# EAGLE design usb-ri (EAGLE 7.7.0)
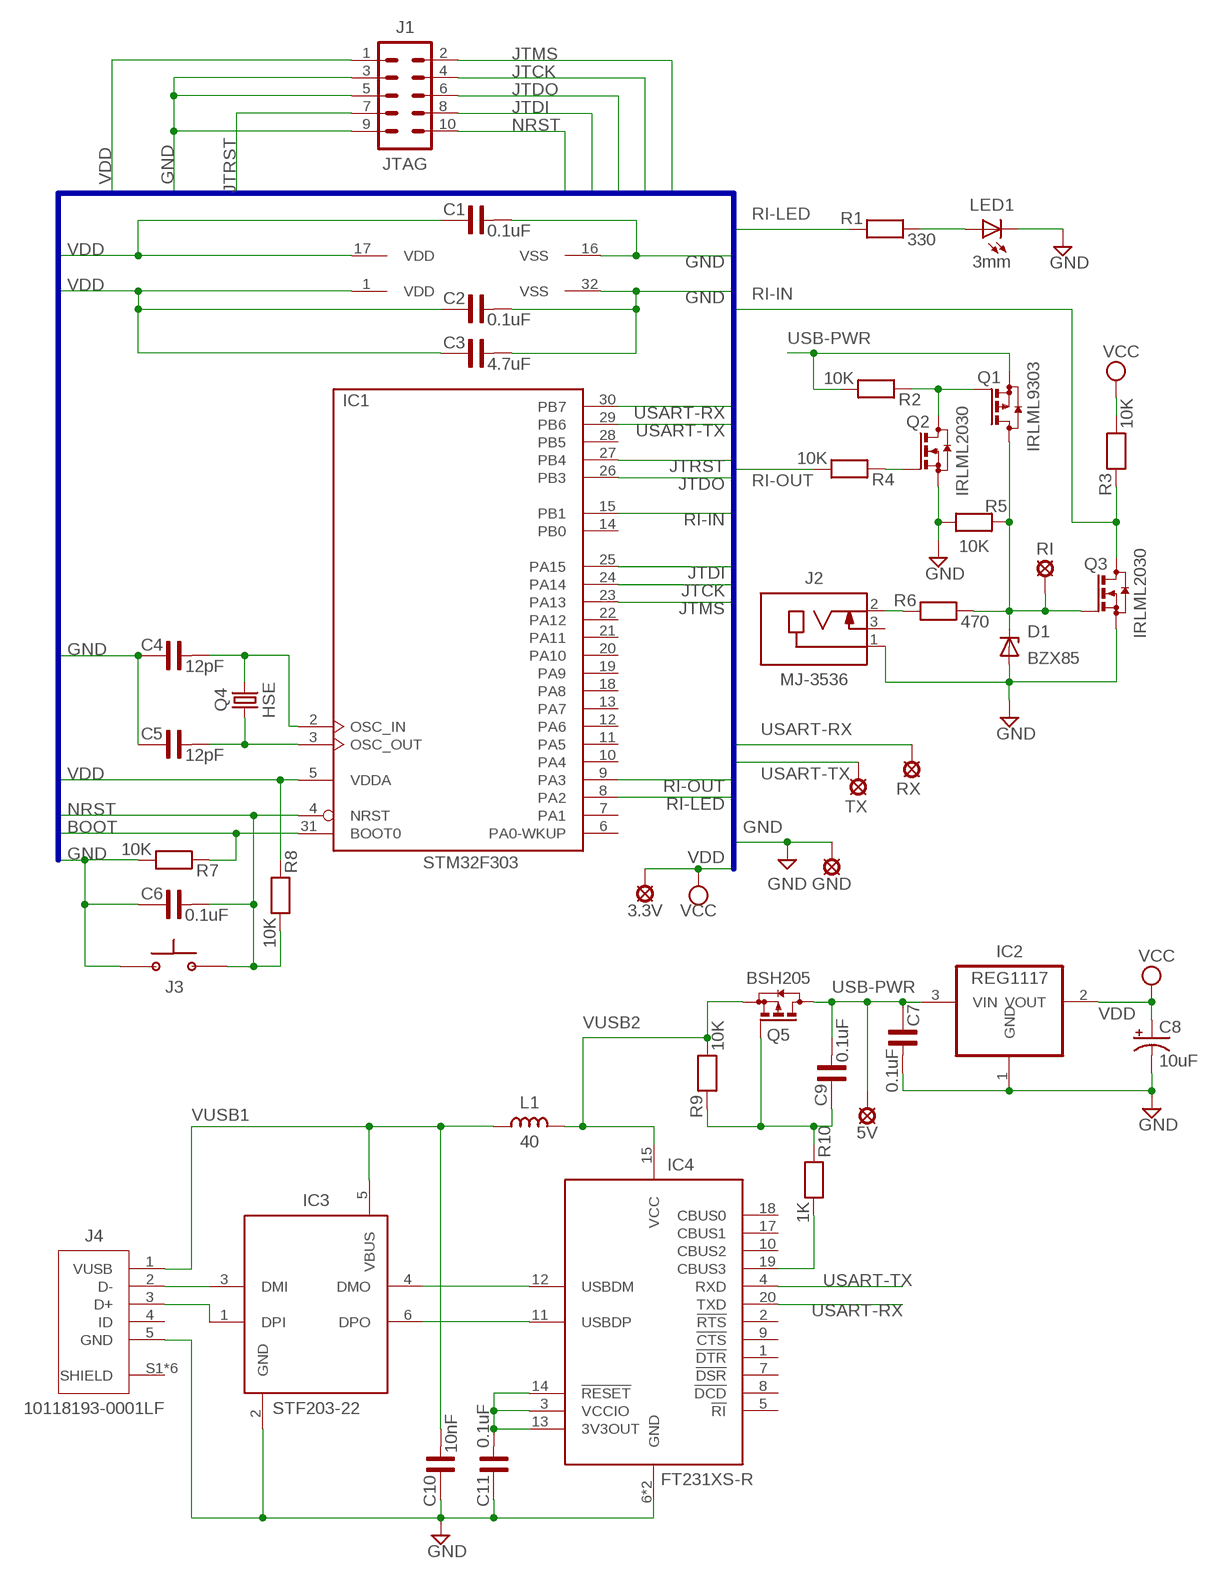
[diagram p0: schematic, sheet 1]

## Parts
3.3V  LSP10  [LSP10]
5V  LSP10  [LSP10]
C1  0.1uF  C-US0805  [C0805]
C2  0.1uF  C-US0805  [C0805]
C3  4.7uF  C-US0805  [C0805]
C4  12pF  C-US0805  [C0805]
C5  12pF  C-US0805  [C0805]
C6  0.1uF  C-US0805  [C0805]
C7  0.1uF  C-US0805  [C0805]
C8  10uF  CPOL-US0805  [CPOL0805]
C9  0.1uF  C-US0805  [C0805]
C10  10nF  C-US0805  [C0805]
C11  0.1uF  C-US0805  [C0805]
D1  BZX85  [DO41Z10]
GND  LSP10  [LSP10]
IC1  STM32F303  STM32F051K4T  [LQFP32]
IC2  REG1117  [SOT223]
IC3  STF203-22  [SC70-6]
IC4  FT231XS-R  [SOP63P599X175-20N]
J1  JTAG  MA05-2  [MA05-2]
J2  MJ-3536  AUDIO-MJ-3536  [AUDIO-MJ-3536]
J3  RESET  BUTTON-FSM14JRT  [BUTTON-FSM14JRT]
J4  10118193-0001LF  MICRO-USB-10118193-0001LF  [MICRO-USB-10118193-0001LF]
L1  40  L-USL0805  [L0805]
LED1  3mm  LEDCHIP-LED0805  [CHIP-LED0805]
Q1  IRLML9303  BSH205G2R  [SOT23]
Q2  IRLML2030  BSS123  [SOT23]
Q3  IRLML2030  BSS123  [SOT23]
Q4  HSE  Q-HSEFA-128  [Q-FA-128]
Q5  BSH205  BSH205G2R  [SOT23]
R1  330  R-US0805  [R0805]
R2  10K  R-US0805  [R0805]
R3  10K  R-US0805  [R0805]
R4  10K  R-US0805  [R0805]
R5  10K  R-US0805  [R0805]
R6  470  R-US1206  [R1206]
R7  10K  R-US0805  [R0805]
R8  10K  R-US0805  [R0805]
R9  10K  R-US0805  [R0805]
R10  1K  R-US0805  [R0805]
RI  LSP10  [LSP10]
RX  LSP10  [LSP10]
TX  LSP10  [LSP10]

## Nets
BOOT: IC1.31(BOOT0) R7.1
D+: IC3.1(DPI) J4.3(D+)
D-: IC3.3(DMI) J4.2(D-)
GND: C1.2 C2.2 C3.2 C4.1 C5.1 C6.1 C7.2 C8.2-(-) C10.1 C11.1 D1.A GND.MP IC1.16(VSS) IC1.32(VSS) IC2.1(GND) IC3.2(GND) IC4.6(GND) IC4.16(GND) J1.3 J1.5 J1.9 J2.1 J3.P$1 J4.5(GND) LED1.C Q2.2(S) Q3.2(S) R5.2 R7.2
JTCK: IC1.24(PA14) J1.4
JTDI: IC1.25(PA15) J1.8
JTDO: IC1.26(PB3) J1.6
JTMS: IC1.23(PA13) J1.2
JTRST: IC1.27(PB4) J1.7
N$4: Q1.1(G) Q2.3(D) R2.1
N$5: J2.2 R6.1
N$10: IC3.4(DMO) IC4.12(USBDM)
N$11: C5.2 IC1.3(OSC_OUT) Q4.1
N$13: IC3.6(DPO) IC4.11(USBDP)
N$17: LED1.A R1.2
N$22: C11.2 IC4.3(VCCIO) IC4.13(3V3OUT) IC4.14(!RESET)
N$24: Q2.1(G) R4.1
N$26: C9.1 Q5.1(G) R9.1 R10.1
N$27: IC4.19(CBUS3) R10.2
N$29: D1.C Q1.3(D) Q3.1(G) R5.1 R6.2 RI.MP
N$44: C4.2 IC1.2(OSC_IN) Q4.3
NRST: C6.2 IC1.4(NRST) J1.10 J3.P$2 R8.2
RI-IN: IC1.15(PB1) Q3.3(D) R3.1
RI-LED: IC1.8(PA2) R1.1
RI-OUT: IC1.9(PA3) R4.2
USART-RX: IC1.30(PB7) IC4.20(TXD) RX.MP
USART-TX: IC1.29(PB6) IC4.4(RXD) TX.MP
USB-PWR: 5V.MP C7.1 C9.2 IC2.3(VIN) Q1.2(S) Q5.3(D) R2.2
VDD: 3.3V.MP C1.1 C2.1 C3.1 C8.1+(+) IC1.1(VDD) IC1.5(VDDA) IC1.17(VDD) IC2.2(VOUT) J1.1 R3.2 R8.1 ; supply symbol labelled VCC
VUSB1: C10.2 IC3.5(VBUS) J4.1(VUSB) L1.1
VUSB2: IC4.15(VCC) L1.2 Q5.2(S) R9.2
Unconnected: IC1.6(PA0-WKUP) IC1.7(PA1) IC1.10(PA4) IC1.11(PA5) IC1.12(PA6) IC1.13(PA7) IC1.14(PB0) IC1.18(PA8) IC1.19(PA9) IC1.20(PA10) IC1.21(PA11) IC1.22(PA12) IC1.28(PB5) IC4.1(!DTR) IC4.2(!RTS) IC4.5(!RI) IC4.7(!DSR) IC4.8(!DCD) IC4.9(!CTS) IC4.10(CBUS2) IC4.17(CBUS1) IC4.18(CBUS0) J2.3 J4.4(ID) J4.S1(SHIELD) J4.S2(SHIELD) J4.S3(SHIELD) J4.S4(SHIELD) J4.S5(SHIELD) J4.S6(SHIELD)

## Buses
VDD,GND,TRST,TMS,TCK,TDO,TDI,NRST,RI-OUT,RI-IN,RI-LED,USART-RX,USART-TX

## Library data of the parts
3.3V 5V GND RI RX TX = solpad:LSP10: SOLDER PAD drill 1.0 mm, distributor Buerklin, 12H555
C1-C7 C9-C11 = MyComponents:C-US: SMD Multilayer Ceramic Capacitor; MOUSER: 80-C0805C104J5RAUTO
C8 = MyComponents:CPOL-US: SMT Tantalum Capacitor; MOUSER: 581-TAJR225K016RNJ
D1 = diode:BZX85: Z DIODE
IC1 = stm32:STM32F051K*T: ARM 32-bit Cortex™-M0 CPU 48 MHz maximum frequency 16 to 32 Kbytes of Flash memory 4 kbytes of SRAM 25 GPIOs 2.0 to 3.6 V application supply
IC2 = MyComponents:REG1117: 800mA and 1A Low Dropout (LDO) Positive Regulator 1.8V, 2.5V, 2.85V, 3.3V, 5V, and Adj; MOUSER: 511-LD1117S33
IC3 = MyComponents:STF203: USB EMI filtering and ESD protection; MOUSER: 947-STF203-22.TCT
IC4 = MyComponents:FT231XS-R: USB Full Speed to Full Handshake UART with USB Charger Detection Check prices <https://pricing.snapeda.com/parts/FT231XS-R/FTDI%20Chip/view-part?ref=eda>; AVAILABILITY: In Stock; DESCRIPTION: FTDI Chip UART RS232, RS422, RS485, SIE, UART 20-Pin SSOP, FT231XS-R; MF: FTDI Chip; MP: FT231XS-R; PACKAGE: SSOP-20 FTDI; PRICE: None; PURCHASE-URL: https://pricing.snapeda.com/search/part/FT231XS-R/?ref=eda
J1 = MyComponents:MA05-2: Headers & Wire Housing, 2 Row, 10 Position
J2 = MyComponents:AUDIO-MJ-3536: 3.5 mm, Mono, Right Angle, Through Hole, Threaded Bushing, Audio Jack Connector Check prices <https://pricing.snapeda.com/parts/MJ-3536/CUI%20Devices/view-part?ref=eda>; DESCRIPTION: 3.5 mm, Mono, Right Angle, Through Hole, Threaded Bushing, 2 Conductors, 1 Internal Switch, Audio Jack Connector; MOUSER: 490-MJ-3536
J3 = MyComponents:BUTTON-FSM14JRT: TE Connectivity / Alcoswitch Round Switch; MOUSER: 506-1571010-1
J4 = MyComponents:MICRO-USB-10118193-0001LF: Micro USB B Type Receptacle Check prices <https://pricing.snapeda.com/parts/10118193-0001LF/Amphenol%20ICC%20%28FCI%29/view-part?ref=eda>; DESCRIPTION: USB - micro B USB 2.0 Receptacle Connector 5 Position Surface Mount, Right Angle; Through Hole; MF: Amphenol ICC (FCI); MOUSER: 649-10118193-0001LF
L1 = MyComponents:L-US: SMD Ferrite Bead; MOUSER: 963-CKP2012N1R0M-T
LED1 = led:LED: LED OSRAM: - CHIPLED LG R971, LG N971, LY N971, LG Q971, LY Q971, LO R971, LY R971 LH N974, LH R974 LS Q976, LO Q976, LY Q976 LO Q996 - Hyper CHIPLED LW Q18S LB Q993, LB Q99A, LB R99A - SideLED LS A670, LO A670, LY A670, LG A670, LP A670 LB A673, LV A673, LT A673, LW A673 LH A674 LY A675 LS A676, LA A676, LO A676, LY A676, LW A676 LS A679, LY A679, LG A679 - Hyper Micro SIDELED® LS Y876, LA Y876, LO Y876, LY Y876 LT Y87S - SmartLED LW L88C, LW L88S LB L89C, LB L89S, LG L890 LS L89K, LO L89K, LY L89K LS L896, LA L896, LO L896, LY L896 - TOPLED LS T670, LO T670, LY T670, LG T670, LP T670 LSG T670, LSP T670, LSY T670, LOP T670, LYG T670 LG T671, LOG T671, LSG T671 LB T673, LV T673, LT T673, LW T673 LH T674 LS T676, LA T676, LO T676, LY T676, LB T676, LH T676, LSB T676, LW T676 LB T67C, LV T67C, LT T67C, LS T67K, LO T67K, LY T67K, LW E67C LS E67B, LA E67B, LO E67B, LY E67B, LB E67C, LV E67C, LT E67C LW T67C LS T679, LY T679, LG T679 LS T770, LO T770, LY T770, LG T770, LP T770 LB T773, LV T773, LT T773, LW T773 LH T774 LS E675, LA E675, LY E675, LS T675 LS T776, LA T776, LO T776, LY T776, LB T776 LHGB T686 LT T68C, LB T68C - Hyper Mini TOPLED® LB M676 - Mini TOPLED Santana® LG M470 LS M47K, LO M47K, LY M47K Source: http://www.osram.convergy.de LUXEON: - LUMILED® LXK2-PW12-R00, LXK2-PW12-S00, LXK2-PW14-U00, LXK2-PW14-V00 LXK2-PM12-R00, LXK2-PM12-S00, LXK2-PM14-U00 LXK2-PE12-Q00, LXK2-PE12-R00, LXK2-PE12-S00, LXK2-PE14-T00, LXK2-PE14-U00 LXK2-PB12-K00, LXK2-PB12-L00, LXK2-PB12-M00, LXK2-PB14-N00, LXK2-PB14-P00, LXK2-PB14-Q00 LXK2-PR12-L00, LXK2-PR12-M00, LXK2-PR14-Q00, LXK2-PR14-R00 LXK2-PD12-Q00, LXK2-PD12-R00, LXK2-PD12-S00 LXK2-PH12-R00, LXK2-PH12-S00 LXK2-PL12-P00, LXK2-PL12-Q00, LXK2-PL12-R00 Source: www.luxeon.com KINGBRIGHT: KA-3528ASYC Source: www.kingbright.com
Q1 Q5 = MyComponents:BSH205G2R: P-channel enhancement mode MOSFET (-2.3A); MOUSER: 771-BSH205G2R
Q2 Q3 = transistor-small-signal:BSS123: N-CHANNEL MOS FET
Q4 = MyComponents:Q-HSE: HSE SMD Crystal; MOUSER: 732-FA12816F20X-AJ0
R1-R5 R7-R10 = MyComponents:R-US: SMD Resistor; MOUSER: 660-RK73H2ATTDD1R00F
R6 = MyComponents:R-US: SMD Resistor

## Board
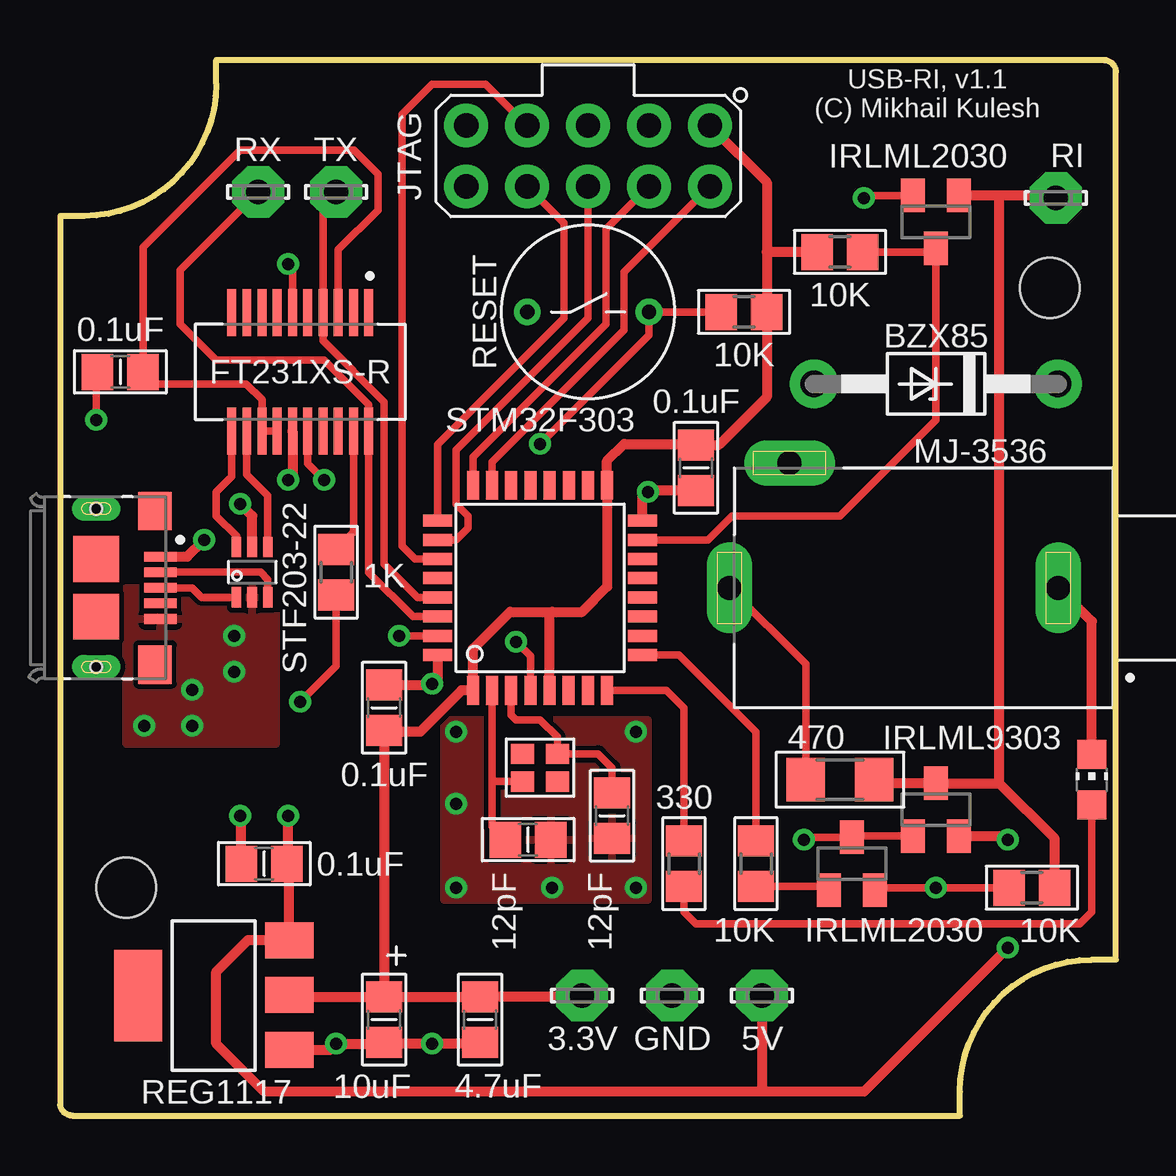
[diagram p1: board, top side]
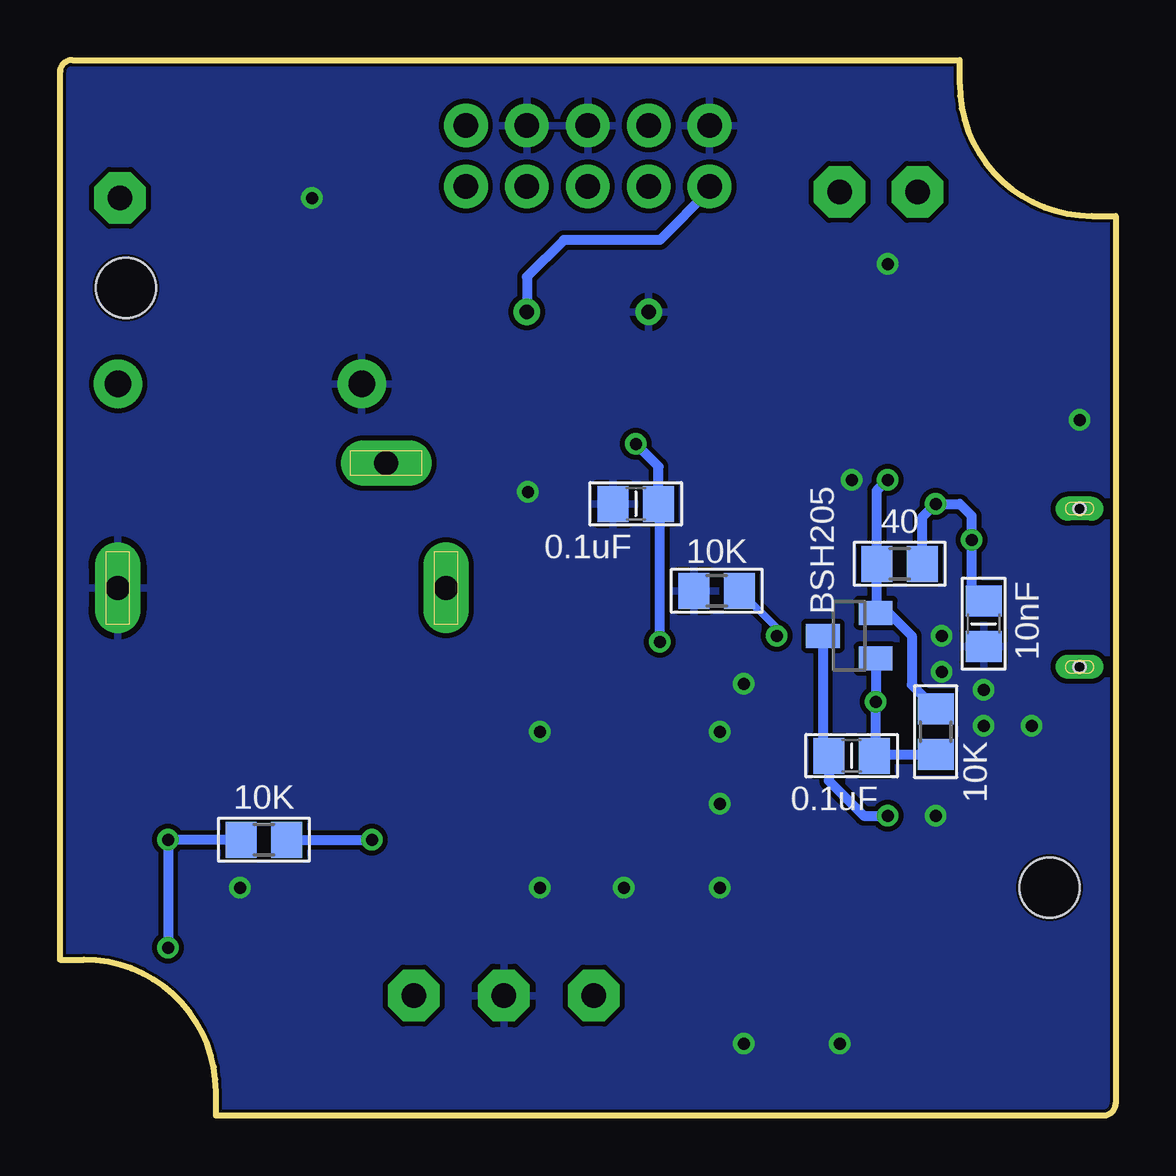
[diagram p2: board, bottom side, seen from below]

Size 44 x 44 mm. Coordinates in mm from the lower left corner, seen from the top.
Outline: 44,6.5 44,43.5 arc90 43.5,44 6.5,44 6.5,43 arc-90 1,37.5 0,37.5 0,0.5 arc90 0.5,0 37.5,0 37.5,1 arc-90 43,6.5 44,6.5
Copper layers (1*16): Top 0.035mm / dielectric 1.5mm / Bottom 0.035mm
Design rules "digital": minimum track width 10mil, minimum drill 19mil, track to track 8mil, track to pad 8mil, pad to pad 7mil, via to via 12mil, smd to smd 7mil, copper to edge 5mil, drill to drill 30mil, minimum pad ring 10mil, minimum via ring 8mil, stop-mask expansion 4mil, vias tented up to drill 0mil, thermal gap 10mil
Holes 2.5 mm at 2.75,9.5 41.25,34.5

### Footprints (pad centres in the part's own frame; a part is rotated, then mirrored left to right if it is on the bottom)
LSP10 = drill 1.016 pad 2.159 octagon: MP 0,0
C0805 = smd 1.3 x 1.5: 1 -0.95,0; 2 0.95,0
CPOL0805 = smd 1.3 x 1.5: 1+ -0.95,0; 2- 0.95,0
DO41Z10 = drill 1.118: A 5.08,0; C -5.08,0
LQFP32 = smd 0.5 x 1.2: 1 -2.8,-4.275; 2 -2,-4.275; 3 -1.2,-4.275; 4 -0.4,-4.275; 5 0.4,-4.275; 6 1.19,-4.275; 7 1.99,-4.275; 8 2.79,-4.275; 17 2.8,4.275; 18 2,4.275; 19 1.2,4.275; 20 0.4,4.275; 21 -0.4,4.275; 22 -1.2,4.275; 23 -2,4.275; 24 -2.8,4.275 | smd 1.2 x 0.5: 9 4.275,-2.8; 10 4.275,-2; 11 4.275,-1.2; 12 4.275,-0.4; 13 4.275,0.4; 14 4.275,1.2; 15 4.275,2; 16 4.275,2.8; 25 -4.275,2.8; 26 -4.275,2; 27 -4.275,1.2; 28 -4.275,0.4; 29 -4.275,-0.4; 30 -4.275,-1.2; 31 -4.275,-2; 32 -4.275,-2.8
SOT223 = smd 1.499 x 2.007: 1 -2.261,-3.15; 2 0.025,-3.15; 3 2.311,-3.15 | smd 3.81 x 2.007: 4 0,3.15
SC70-6 = smd 0.4 x 0.85: 1 -0.65,-1.05; 2 0,-1.05; 3 0.65,-1.05; 4 0.65,1.05; 5 0,1.05; 6 -0.65,1.05
SOP63P599X175-20N = smd 1.97 x 0.41: 1 -2.47,2.857; 2 -2.47,2.223; 3 -2.47,1.587; 4 -2.47,0.953; 5 -2.47,0.318; 6 -2.47,-0.318; 7 -2.47,-0.953; 8 -2.47,-1.587; 9 -2.47,-2.223; 10 -2.47,-2.857; 11 2.47,-2.857; 12 2.47,-2.223; 13 2.47,-1.587; 14 2.47,-0.953; 15 2.47,-0.318; 16 2.47,0.318; 17 2.47,0.953; 18 2.47,1.587; 19 2.47,2.223; 20 2.47,2.857
MA05-2 = drill 1.016: 1 -5.08,-1.27; 2 -5.08,1.27; 3 -2.54,-1.27; 4 -2.54,1.27; 5 0,-1.27; 6 0,1.27; 7 2.54,-1.27; 8 2.54,1.27; 9 5.08,-1.27; 10 5.08,1.27
AUDIO-MJ-3536 = drill 1 pad 1.9 long: 1 -5.6,0; 2 8.1,0; 3 5.6,-5.2
BUTTON-FSM14JRT = drill 0.6: P$1 -2.54,0; P$2 2.54,0
MICRO-USB-10118193-0001LF = smd 0.4 x 1.35: 1 -1.3,2.675; 2 -0.65,2.675; 3 0,2.675; 4 0.65,2.675; 5 1.3,2.675 | smd 1.6 x 1.4: S1 -3.2,2.45; S2 3.2,2.45 | smd 1.9 x 1.9: S3 1.2,0; S4 -1.2,0 | drill 0.5 pad 0.9 long: S5 -3.3,0; S6 3.3,0 | hole 0.5: -3.3,0; 3.3,0
L0805 = smd 1.3 x 1.5: 1 -0.95,0; 2 0.95,0
CHIP-LED0805 = smd 1.2 x 1.2: A 0,-1.05; C 0,1.05
SOT23 = smd 1 x 1.4: 1 -0.95,-1.1; 2 0.95,-1.1; 3 0,1.1
Q-FA-128 = smd 0.95 x 0.85: 1 -0.725,-0.575; 2 -0.725,0.575; 3 0.725,0.575; 4 0.725,-0.575
R0805 = smd 1.3 x 1.5: 1 -0.95,0; 2 0.95,0
R1206 = smd 1.6 x 1.803: 1 -1.422,0; 2 1.422,0

### Placement (x,y rotation side)
3.3V  21.75,5 0 top
5V  29.25,5 0 top
C1  13.5,17 90 top
C2  26.5,27 270 top
C3  17.5,4 270 top
C4  19.5,11.5 180 top
C5  23,12.5 90 top
C6  20,25.5 0 bottom
C7  8.5,10.5 180 top
C8  13.5,4 270 top
C9  11,15 180 bottom
C10  5.5,20.5 90 bottom
C11  2.5,31 0 top
D1  36.5,30.5 180 top
GND  25.5,5 0 top
IC1  20,22 0 top
IC2  6.4,5 90 top
IC3  8,22.65 0 top
IC4  10,31 270 top
J1  22,40 180 top
J2  36,22 180 top
J3  22,33.5 0 top
J4  1.5,22 270 top
L1  9,23 180 bottom
LED1  43,14 0 top
Q1  36.5,12.75 0 top
Q2  33,10.5 0 top
Q3  36.5,37.25 180 top
Q4  20,14.5 180 top
Q5  11.1,20 90 bottom
R1  26,10.5 270 top
R2  35.5,11.5 180 bottom
R3  32.5,36 180 top
R4  29,10.5 90 top
R5  40.5,9.5 180 top
R6  32.5,14 0 top
R7  16.62,21.88 180 bottom
R8  28.5,33.5 180 top
R9  7.5,16 90 bottom
R10  11.5,22.65 90 top
RI  41.5,38.25 0 top
RX  8.25,38.5 0 top
TX  11.5,38.5 0 top

### Tracks (layer width: path | path; a pad name or v marks a point on that pad's centre or on a via)
BOOT  (via drill 0.5)
  Top 0.305: IC1.31 v14.12,20
  Bottom 0.305: R7.1 14.12,20.32 v14.12,20
D+
  Top 0.305: J4.3 5.5,22 5.9,21.6 IC3.1
D-
  Top 0.305: J4.2 8.35,22.65 8.65,22.35 IC3.3
GND  (via drill 0.5)
  Top 0.305: 9.55,35.55 v9.5,35.5 9.68,35.32 IC4.6 | IC4.16 10.32,27.18 v11,26.5 | C11.1 1.5,30.95 v1.5,29 | 15.45,17.95 v15.5,18 | Q2.2 34.05,9.5 v36.5,9.5 R5.2 | 13.45,3 C8.2- | C3.2 17.45,3 | Q3.2 33.6,38.35 v33.5,38.25
  Top 0.406: C7.2 7.55,12.45 v7.5,12.5 | IC1.16 24.27,25.77 arc-90 v24.5,26 24.55,26.05 C2.2 | IC1.32 15.72,18.23 arc-90 v15.5,18 | C1.2 15.45,17.95 | IC2.1 11.24,2.74 v11.5,3 13.45,3 | 13.5,3 v15.5,3 17.45,3 | LED1.C 43,20.6 J2.1
  other vias: 16.5,9.5 20.5,9.5 24,9.5 24,16 16.5,16 16.5,13 3.5,16.25 5.5,16.25 5.5,17.75 7.25,18.5 7.25,20
  pour Bottom: 0,44 44,44 44,0 0,0
  pour Top: 16,16.5 16,9 24.5,9 24.5,16.5
  pour Top: 2.75,22 9,22 9,15.5 2.75,15.5
JTCK
  Top 0.305: IC1.24 17.2,27.45 22.75,33 22.75,36.94 J1.4
JTDI
  Top 0.305: IC1.25 15.72,27.98 21,33.25 21,37.19 J1.8
JTDO
  Top 0.305: IC1.26 16.5,24 17,24.5 17,25 16.5,25.5 16.5,27.75 22,33.25 J1.6
JTMS
  Top 0.305: IC1.23 18,27.25 23.5,32.75 23.5,35.15 J1.2
JTRST
  Top 0.305: IC1.27 14.8,23.2 14.25,23.75 14.25,41.75 15.5,43 17.73,43 J1.7
N$4  (via drill 0.5)
  Top 0.305: v31,11.5 31.1,11.6 Q2.3 33.05,11.65 Q1.1
  Bottom 0.406: R2.1 v31,11.5
N$5
  Top 0.305: J2.2 31.08,18.82 R6.1
N$10
  Top 0.305: IC4.12 7.78,26.72 8.65,25.85 IC3.4
N$11
  Top 0.305: IC1.3 18.8,16.7 19,16.5 20,16.5 20.73,15.78 Q4.1 22.43,15.07 23,14.5 C5.2
N$13
  Top 0.305: IC3.6 7.35,24.15 6.5,25 6.5,26 7.14,26.64 IC4.11
N$17
  Top 0.305: R1.2 26,8.5 26.5,8 42.5,8 43,8.5 LED1.A
N$22
  Top 0.305: IC4.14 IC4.13 8.41,29.84 7.75,30.5 3.95,30.5 C11.2 3.45,36.2 7.5,40.25 12.25,40.25 13.25,39.25 13.25,37.75 11.59,36.09 IC4.3
N$24
  Top 0.305: R4.1 31.9,9.55 Q2.1
N$26  (via drill 0.5)
  Top 0.305: 10.05,17.2 v10,17.25 11.5,18.75 R10.1
  Bottom 0.305: 10.05,17.2 v10,17.25 | C9.1 10,15.05
  Bottom 0.406: Q5.1 v10,17.25 10,15.05 R9.1
N$27
  Top 0.305: IC4.19 12.22,24.32 R10.2
N$29
  Top 0.406: R5.1 41.45,11.55 39.15,13.85 | 39.15,13.85 Q1.3 34.07,13.85 R6.2 | 39.15,13.85 39.15,30.5 | 39.15,30.5 39.15,38.2 arc90 39,38.35 | D1.C 39.15,30.5 | RI.MP 41.4,38.35 39,38.35 | 39,38.35 Q3.1
N$44
  Top 0.305: IC1.2 18,14 | 18,14 18,12.05 C4.2 | Q4.3 18.07,13.93 18,14
NRST  (via drill 0.5)
  Top 0.305: IC1.4 19.6,19.15 v19,19.75 | v20,28 24.54,32.54 J3.P$2 R8.2
  Bottom 0.305: 19,25.45 C6.2
  Bottom 0.406: v19,19.75 19,25.45 | C6.2 19.05,27.05 v20,28 | J1.10 16.92,38.58 19,36.5 23,36.5 24.54,34.96 J3.P$2
RI-IN
  Top 0.305: IC1.15 27,24 28,25 32.5,25 36.5,29 Q3.3 36.35,36 R3.1
RI-LED
  Top 0.305: IC1.8 25.27,17.73 26,17 R1.1
RI-OUT
  Top 0.305: IC1.9 25.8,19.2 29,16 R4.2
USART-RX
  Top 0.305: IC1.30 14.7,20.8 12.86,22.64 IC4.20 12.86,29.64 11,31.5 6.5,31.5 5,33 5,35.25 RX.MP
USART-TX
  Top 0.305: IC1.29 14.9,21.6 13.5,23 13.5,29.75 10.95,32.3 IC4.4 10.95,37.95 TX.MP
USB-PWR  (via drill 0.5)
  Top 0.305: 9.55,10.4 C7.1 9.5,10.5 | 39.35,11.65 v39.5,11.5
  Top 0.406: 9.55,10.4 IC2.3 7.81,7.31 6.5,6 6.5,3 8.5,1 29.25,1 | 9.5,10.5 v9.5,12.5 | Q1.2 39.35,11.65 | v39.5,7 33.5,1 29.25,1 | 5V.MP 29.25,1
  Bottom 0.305: 12.2,15.25 arc-90 C9.2 12.2,15
  Bottom 0.406: C9.2 11.95,13.95 10.5,12.5 v9.5,12.5 | Q5.3 12.2,15 | R2.2 v39.5,11.5 v39.5,7
VDD
  Top 0.305: C1.1 13.55,16 13.5,15.95 | 26.45,28 C2.1 | IC2.2 9.62,4.95 | 3.3V.MP 21.7,4.95
  Top 0.406: 20.5,21 18.75,21 17.2,19.45 IC1.1 16.73,17.73 15,16 13.55,16 | 20.5,21 21.75,21 22.8,22.05 IC1.17 22.8,27.3 23.5,28 26.45,28 | IC1.5 20.4,20.9 20.5,21 | 9.62,4.95 C8.1+ | C8.1+ C3.1 21.7,4.95 | 13.5,15.95 C8.1+ | C2.1 27.45,27.95 29.45,29.95 R8.1 29.45,36 | R3.2 29.45,36 | J1.1 29.45,38.9 29.45,36
VUSB1  (via drill 0.5)
  Top 0.406: J4.1 5.3,23.3 v6,24 | IC3.5 8,25 v7.5,25.5
  Bottom 0.406: L1.1 8.05,24.95 v7.5,25.5 6.5,25.5 6,25 v6,24 6,21.95 C10.2
VUSB2  (via drill 0.5)
  Top 0.406: IC4.15 9.68,26.68 v9.5,26.5
  Bottom 0.305: 9.95,21 Q5.2 9.45,20.95
  Bottom 0.406: v9.5,26.5 9.95,26.05 L1.2 9.95,21 | 9.45,20.95 8.5,20 8.5,17.95 R9.2

### Text on the board
tNames: USB-RI, v1.1 / (C) Mikhail Kulesh